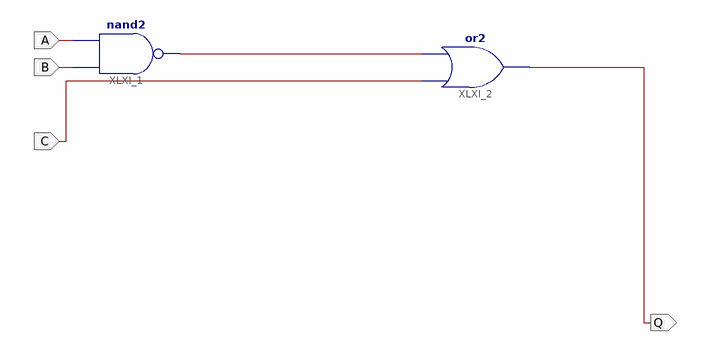
[diagram p0: schematic sheet 1]
// Xilinx ISE schematic example1.sch (spartan3e) as structural Verilog: 2 symbols, 4 ports
module example1 (
  input  C,
  input  B,
  input  A,
  output Q
);

  wire XLXN_4;

  or XLXI_2 (Q, C, XLXN_4);
  nand XLXI_1 (XLXN_4, B, A);
endmodule
